# Altium schematic sheet MK20DXschematic.SchDoc
size A4
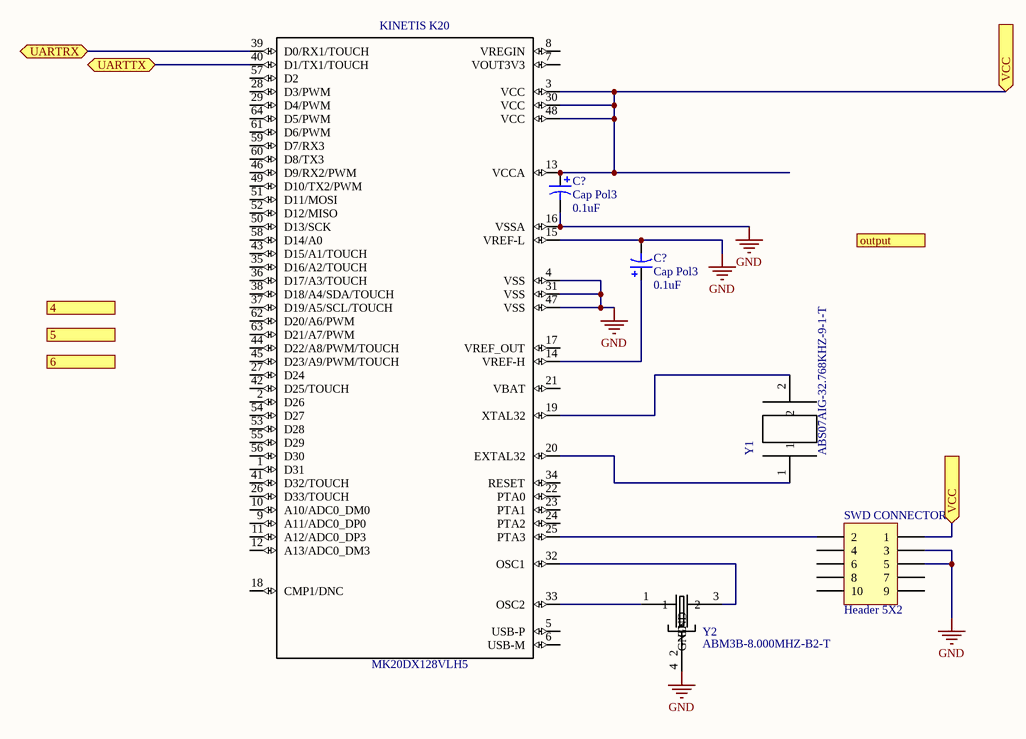
[diagram p0: MK20DXschematic.SchDoc]

## Parts
(Parts that share a designator on the sheet are numbered #1, #2 ... from top to bottom, then left to right.)
C?#1  Cap Pol3  value 0.1uF  [C0805]
C?#2  Cap Pol3  value 0.1uF  [C0805]
KINETIS_K20  MK20DX128VLH5  [QFP50P1200X1200X160-64N]
SWD_CONNECTOR  Header 5X2  [HDR2X5]
Y1  ABS07AIG-32.768KHZ-9-1-T  [XTAL320X150X90]
Y2  ABM3B-8.000MHZ-B2-T  [OSCSC500X320X110-4N]

## Ports
4, 5, 6, output, UARTRX (bidir), UARTTX (bidir), VCC (in)

## Nets
GND: C?#1.2 C?#2.2 KINETIS_K20.4(VSS) KINETIS_K20.15(VREF-L) KINETIS_K20.16(VSSA) KINETIS_K20.31(VSS) KINETIS_K20.47(VSS) SWD_CONNECTOR.3 SWD_CONNECTOR.5 Y2.4(GND)
UARTRX: KINETIS_K20.39(D0/RX1/TOUCH) ; port UARTRX
UARTTX: KINETIS_K20.40(D1/TX1/TOUCH) ; port UARTTX
VCC: C?#1.1 KINETIS_K20.3(VCC) KINETIS_K20.13(VCCA) KINETIS_K20.30(VCC) KINETIS_K20.48(VCC) SWD_CONNECTOR.1 ; port VCC
NetC?#2_1: C?#2.1 KINETIS_K20.14(VREF-H)
NetKINETIS_K20_19: KINETIS_K20.19(XTAL32) Y1.2
NetKINETIS_K20_20: KINETIS_K20.20(EXTAL32) Y1.1
NetKINETIS_K20_25: KINETIS_K20.25(PTA3) SWD_CONNECTOR.2
NetKINETIS_K20_32: KINETIS_K20.32(OSC1) Y2.3(2)
NetKINETIS_K20_33: KINETIS_K20.33(OSC2) Y2.1

Not connected (* = marked no-connect by the designer): KINETIS_K20 1(D31) 2(D26) 5(USB-P) 6(USB-M) 7(VOUT3V3) 8(VREGIN) 9(A11/ADC0_DP0) 10(A10/ADC0_DM0) 11(A12/ADC0_DP3) 12(A13/ADC0_DM3) 17(VREF_OUT) 18(CMP1/DNC) 21(VBAT) 22(PTA0) 23(PTA1) 24(PTA2) 26(D33/TOUCH) 27(D24) 28(D3/PWM) 29(D4/PWM) 34(RESET) 35(D16/A2/TOUCH) 36(D17/A3/TOUCH) 37(D19/A5/SCL/TOUCH) 38(D18/A4/SDA/TOUCH) 41(D32/TOUCH) 42(D25/TOUCH) 43(D15/A1/TOUCH) 44(D22/A8/PWM/TOUCH) 45(D23/A9/PWM/TOUCH) 46(D9/RX2/PWM) 49(D10/TX2/PWM) 50(D13/SCK) 51(D11/MOSI) 52(D12/MISO) 53(D28) 54(D27) 55(D29) 56(D30) 57(D2) 58(D14/A0) 59(D7/RX3) 60(D8/TX3) 61(D6/PWM) 62(D20/A6/PWM) 63(D21/A7/PWM) 64(D5/PWM); SWD_CONNECTOR 4 6 7 8 9 10; Y2 2(GND)

## Library data of the parts
C?#1 C?#2 = Cap Pol3: Polarized Capacitor (Surface Mount); Published: 8-Jun-2000; LatestRevisionDate: 29-May-2009; LatestRevisionNote: IPC-7351 Footprint Added.; PackageReference: C0805; Publisher: Altium Limited; PackageDescription: Chip Capacitor
KINETIS_K20 = MK20DX128VLH5: MCU 32-bit Kinetis K20 ARM Cortex M4 RISC 128KB Flash 1.8V/2.5V/3.3V 64-Pin LQFP Tray; pin to pad: 17>none; MF: NXP Semiconductors; Package: LQFP-64 NXP Semiconductors; Price: 4.22 USD; MP: MK20DX128VLH5; Availability: Good; Value: *
SWD_CONNECTOR = Header 5X2: Header, 5-Pin, Dual row; LatestRevisionDate: 17-Jul-2002; LatestRevisionNote: Re-released for DXP Platform.; Publisher: Altium Limited
Y1 = ABS07AIG-32.768KHZ-9-1-T: Crystal 32.768khz 9pf Smd; MF: Abracon; MP: ABS07AIG-32.768KHZ-9-1-T; Package: SMD-2 Abracon; Availability: Good; Price: 0.53 USD; Value: *
Y2 = ABM3B-8.000MHZ-B2-T: Crystal 8MHz %C2%B120ppm %28Tol%29 %C2%B150ppm %28Stability%29 18pF FUND 200Ohm 4-Pin CSMD T/R; MF: Abracon; MP: ABM3B-8.000MHZ-B2-T; Package: SMD-4 Abracon; Availability: Good; Price: 0.45 USD; Value: *